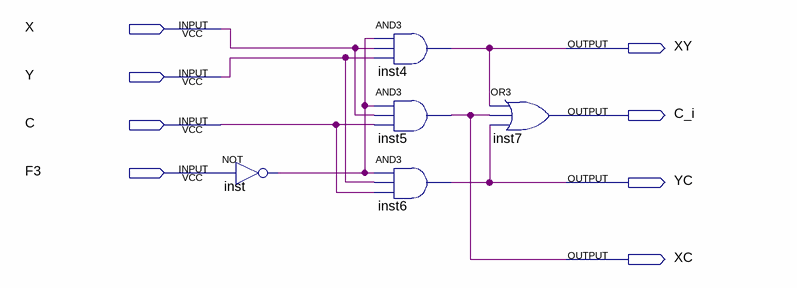
[diagram p0: schematic sheet]
// Quartus schematic c.bdf as structural Verilog: 5 symbols, 8 pins
module c (
  input  X,
  input  Y,
  input  C,
  input  F3,
  output XY,
  output C_i,
  output YC,
  output XC
);

  wire inst_out;

  not inst (inst_out, F3);
  and inst4 (XY, inst_out, X, Y);
  and inst5 (XC, inst_out, X, C);
  and inst6 (YC, inst_out, Y, C);
  or inst7 (C_i, XY, XC, YC);
endmodule
